# Altium schematic sheet TOP.SchDoc: =DocumentName
size A4; Organization: Queen's Formula SAE; Address1: 130 Stuart St, Kingston; Address2: Ontario; Address3: Canada; Address4: K7L 2V9; DocumentNumber: 1; Revision: 0; SheetNumber: 1; SheetTotal: 1
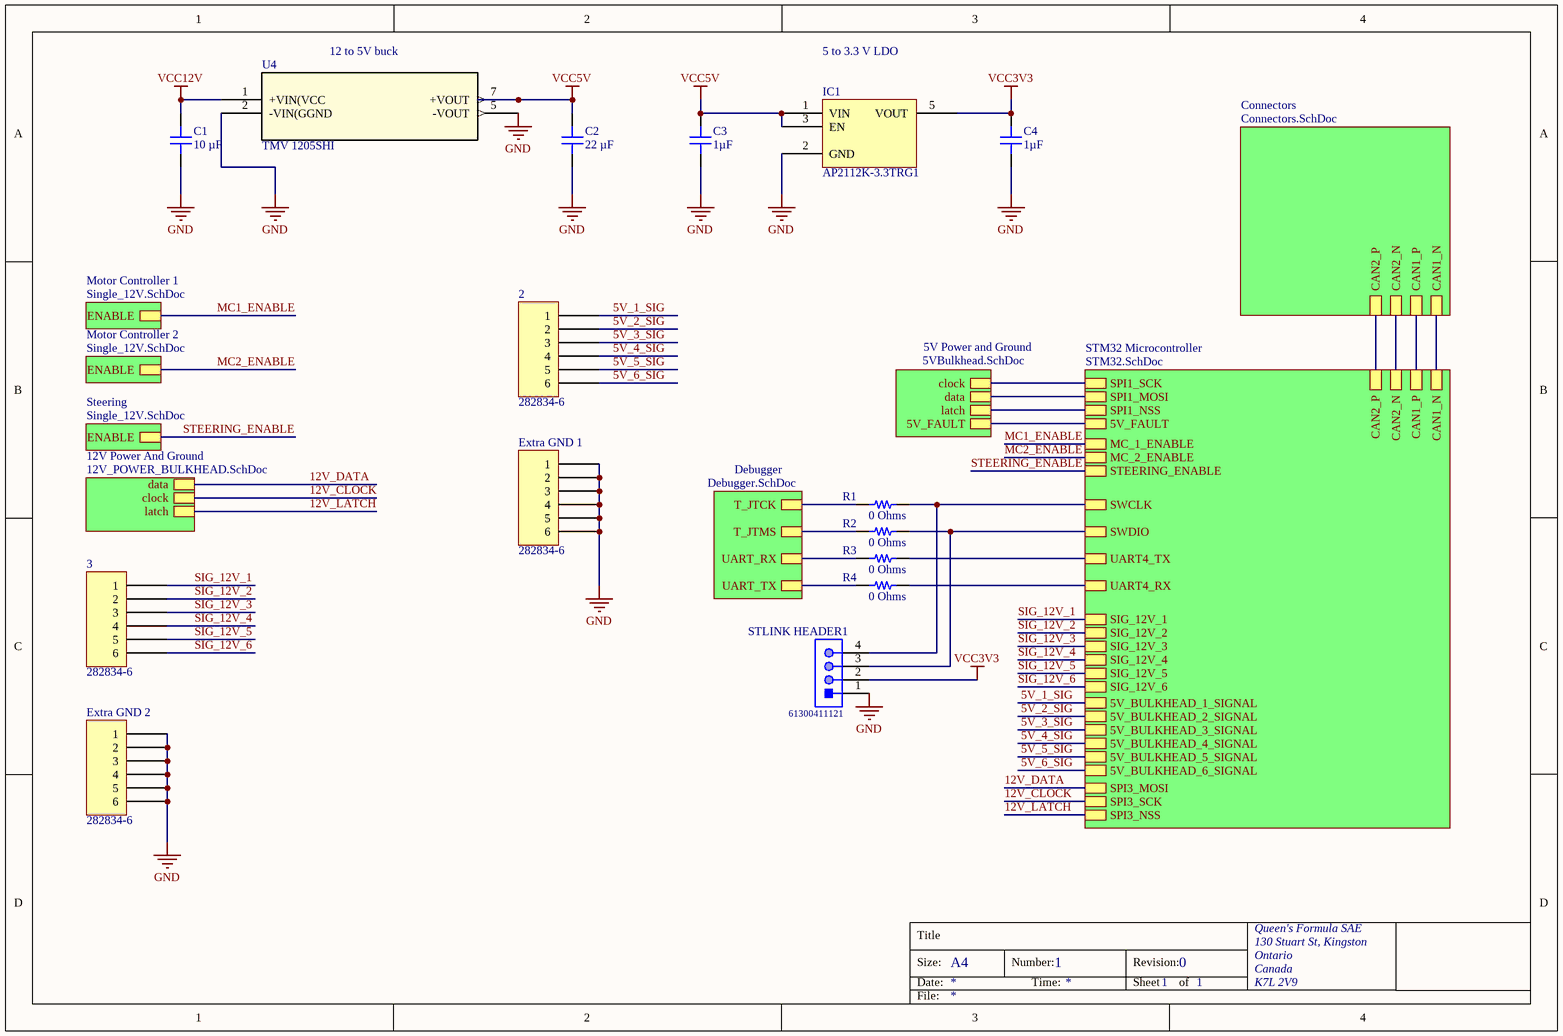
[diagram p0: TOP.SchDoc]

## Parts
2  282834-6  [TE 282834-6]
3  282834-6  [TE 282834-6]
C1  10 µF  [CAP 0603_1608]
C2  22 µF  [CAP 0603_1608]
C3  1µF  [CAP 0402_1005]
C4  1µF  [CAP 0402_1005]
Extra_GND_1  282834-6  [TE 282834-6]
Extra_GND_2  282834-6  [TE 282834-6]
IC1  AP2112K-3.3TRG1  [DIODES SOT-23-5 W5]
R1  0 Ohms  [RES 0603_1608]
R2  0 Ohms  [RES 0603_1608]
R3  0 Ohms  [RES 0603_1608]
R4  0 Ohms  [RES 0603_1608]
STLINK_HEADER1  61300411121  [61300411121]
U4  TMV 1205SHI  [TMV-HI_SINGLE_TRP]

## Sub-sheets
5V Power and Ground = 5VBulkhead.SchDoc: data, clock, latch, 5V_FAULT
12V Power And Ground = 12V_POWER_BULKHEAD.SchDoc: data, clock, latch
Connectors = Connectors.SchDoc: CAN1_N, CAN1_P, CAN2_N, CAN2_P
Debugger = Debugger.SchDoc: T_JTCK, T_JTMS, UART_RX, UART_TX
Motor Controller 1 = Single_12V.SchDoc: ENABLE
Motor Controller 2 = Single_12V.SchDoc: ENABLE
Steering = Single_12V.SchDoc: ENABLE
STM32 Microcontroller = STM32.SchDoc: SPI1_NSS, SPI1_SCK, SPI1_MOSI, MC_1_ENABLE, MC_2_ENABLE, STEERING_ENABLE, CAN1_P, CAN1_N, 5V_BULKHEAD_1_SIGNAL, 5V_BULKHEAD_2_SIGNAL, 5V_BULKHEAD_3_SIGNAL, 5V_BULKHEAD_4_SIGNAL, 5V_BULKHEAD_5_SIGNAL, 5V_BULKHEAD_6_SIGNAL, CAN2_N, CAN2_P, SWCLK, SPI3_NSS, SPI3_MOSI, SPI3_SCK, SIG_12V_1, SIG_12V_2, SIG_12V_3, SIG_12V_4, SIG_12V_5, SIG_12V_6, SWDIO, UART4_TX, UART4_RX, 5V_FAULT

## Nets
GND: C1.1 C2.1 C3.1 C4.1 Extra_GND_1.1 Extra_GND_1.2 Extra_GND_1.3 Extra_GND_1.4 Extra_GND_1.5 Extra_GND_1.6 Extra_GND_2.1 Extra_GND_2.2 Extra_GND_2.3 Extra_GND_2.4 Extra_GND_2.5 Extra_GND_2.6 IC1.2(GND) STLINK_HEADER1.1 U4.2(-VIN(GGND) U4.5(-VOUT)
VCC3V3: C4.2 IC1.5(VOUT) STLINK_HEADER1.2
VCC5V: C2.2 C3.2 IC1.1(VIN) IC1.3(EN) U4.7(+VOUT)
VCC12V: C1.2 U4.1(+VIN(VCC)
5V_1_SIG: 2.1 ; sheet STM32 Microcontroller/5V_BULKHEAD_1_SIGNAL
5V_2_SIG: 2.2 ; sheet STM32 Microcontroller/5V_BULKHEAD_2_SIGNAL
5V_3_SIG: 2.3 ; sheet STM32 Microcontroller/5V_BULKHEAD_3_SIGNAL
5V_4_SIG: 2.4 ; sheet STM32 Microcontroller/5V_BULKHEAD_4_SIGNAL
5V_5_SIG: 2.5 ; sheet STM32 Microcontroller/5V_BULKHEAD_5_SIGNAL
5V_6_SIG: 2.6 ; sheet STM32 Microcontroller/5V_BULKHEAD_6_SIGNAL
12V_CLOCK: sheet STM32 Microcontroller/SPI3_SCK, sheet 12V Power And Ground/clock
12V_DATA: sheet STM32 Microcontroller/SPI3_MOSI, sheet 12V Power And Ground/data
12V_LATCH: sheet STM32 Microcontroller/SPI3_NSS, sheet 12V Power And Ground/latch
MC1_ENABLE: sheet STM32 Microcontroller/MC_1_ENABLE, sheet Motor Controller 1/ENABLE
MC2_ENABLE: sheet STM32 Microcontroller/MC_2_ENABLE, sheet Motor Controller 2/ENABLE
SIG_12V_1: 3.1 ; sheet STM32 Microcontroller/SIG_12V_1
SIG_12V_2: 3.2 ; sheet STM32 Microcontroller/SIG_12V_2
SIG_12V_3: 3.3 ; sheet STM32 Microcontroller/SIG_12V_3
SIG_12V_4: 3.4 ; sheet STM32 Microcontroller/SIG_12V_4
SIG_12V_5: 3.5 ; sheet STM32 Microcontroller/SIG_12V_5
SIG_12V_6: 3.6 ; sheet STM32 Microcontroller/SIG_12V_6
STEERING_ENABLE: sheet STM32 Microcontroller/STEERING_ENABLE, sheet Steering/ENABLE
NetR1_1: R1.1 ; sheet Debugger/T_JTCK
NetR1_2: R1.2 STLINK_HEADER1.4 ; sheet STM32 Microcontroller/SWCLK
NetR2_1: R2.1 ; sheet Debugger/T_JTMS
NetR2_2: R2.2 STLINK_HEADER1.3 ; sheet STM32 Microcontroller/SWDIO
NetR3_1: R3.1 ; sheet Debugger/UART_RX
NetR3_2: R3.2 ; sheet STM32 Microcontroller/UART4_TX
NetR4_1: R4.1 ; sheet Debugger/UART_TX
NetR4_2: R4.2 ; sheet STM32 Microcontroller/UART4_RX
(unnamed): sheet STM32 Microcontroller/SPI1_NSS, sheet 5V Power and Ground/latch
(unnamed): sheet STM32 Microcontroller/SPI1_SCK, sheet 5V Power and Ground/clock
(unnamed): sheet STM32 Microcontroller/SPI1_MOSI, sheet 5V Power and Ground/data
(unnamed): sheet STM32 Microcontroller/CAN1_P, sheet Connectors/CAN1_P
(unnamed): sheet STM32 Microcontroller/CAN1_N, sheet Connectors/CAN1_N
(unnamed): sheet STM32 Microcontroller/CAN2_N, sheet Connectors/CAN2_N
(unnamed): sheet STM32 Microcontroller/CAN2_P, sheet Connectors/CAN2_P
(unnamed): sheet STM32 Microcontroller/5V_FAULT, sheet 5V Power and Ground/5V_FAULT

## Notes on the sheet
- (near U4) 12 to 5V buck
- 5 to 3.3 V LDO
- Title
- Size:
- Date:
- A4
- Number:
- Time:
- Revision:
- Sheet
- of
- File:

## Library data of the parts
2 3 Extra_GND_1 Extra_GND_2 = 282834-6: TERM BLK 6P SIDE ENT 2.54MM PCB; Manufacturer: TE Connectivity AMP Connectors; Current: 10A; Mating Orientation: Horizontal with Board; Number of Levels: 1; Pitch: 0.100" (2.54mm); Positions Per Level: 6; Voltage: 150V; Wire Gauge: 16-30 AWG; Wire Termination: Screw - Rising Cage Clamp; Part Number: 282834-6; Color: Green; ComponentLink1Description: Datasheet; ComponentLink1URL: https://www.te.com/commerce/DocumentDelivery/DDEController?Action=srchrtrv&DocNm=282834&DocType=Customer+Drawing&DocLang=English; ComponentLink2Description: DigiKey Link; ComponentLink2URL: http://digikey.com/product-detail/en/te-connectivity-amp-connectors/282834-6/A98337-ND/1153267; LastUpdated: 2020-01-15 4:16:31 AM; Lifecycle Status: Active; Minimum Order: 1; Mounting Type: Through Hole; Packaging: Bulk; Part Status: Active; Price: 4.72; Series: Buchanan; Supplier 1: DigiKey; Supplier Part Number 1: A98337-ND
C1 = GRT188R61C106ME13D: CAP CER 10UF 16V X5R 0603; manufacturer: Murata Electronics; Tolerance: ±20%; Part Number: GRT188R61C106ME13D; Value: 10 µF; Applications: Automotive; Capacitance: 10 µF; componentlink1description: Datasheet; componentlink1url: https://search.murata.co.jp/Ceramy/image/img/A01X/G101/ENG/GRT188R61C106ME13-01.pdf; componentlink2description: DigiKey Link; componentlink2url: https://www.digikey.com/en/products/detail/murata-electronics/GRT188R61C106ME13D/5416740; Device Package: 0603 (1608 Metric); lastupdated: 2023-06-11 7:15:06 PM; Lifecycle Status: Active; Minimum Order: 1; Mounting Type: Surface Mount, MLCC; Operating Temperature: -55°C ~ 85°C; Package / Case: 0603 (1608 Metric); packaging: TapeAndReel; partid: 2515; Part Status: Active; price: 0.06; Ratings: AEC-Q200; series: GRT; Size / Dimension: 0.063" L x 0.031" W (1.60mm x 0.80mm); Supplier 1: DigiKey; Supplier Part Number 1: 490-12318-1-ND; Temperature Coefficient: X5R; Thickness (Max): 0.035" (0.90mm); Voltage - Rated: 16V
C2 = ZRB186R60J226ME11L: CAP CER 22UF 6.3V X5R 0603; manufacturer: Murata Electronics; Tolerance: ±20%; Part Number: ZRB186R60J226ME11L; Value: 22 µF; Applications: Acoustic Noise Reduction; Capacitance: 22 µF; componentlink1description: Datasheet; componentlink1url: https://psearch.en.murata.com/capacitor/product/ZRB186R60J226ME11%23.pdf; componentlink2description: DigiKey Link; componentlink2url: https://www.digikey.com/en/products/detail/murata-electronics/ZRB186R60J226ME11L/5877417; Device Package: 0603 (1608 Metric); Features: Interposer Termination; lastupdated: 2023-06-11 7:15:06 PM; Lifecycle Status: Active; Minimum Order: 1; Mounting Type: Surface Mount, MLCC; Operating Temperature: -55°C ~ 85°C; Package / Case: 0603 (1608 Metric); packaging: TapeAndReel; partid: 2449; Part Status: Active; price: 0.05; series: ZRB; Size / Dimension: 0.063" L x 0.031" W (1.60mm x 0.80mm); Supplier 1: DigiKey; Supplier Part Number 1: 490-13254-1-ND; Temperature Coefficient: X5R; Thickness (Max): 0.031" (0.80mm); Voltage - Rated: 6.3V
C3 C4 = 0402ZD105KAT4A: CAP CER 1UF 10V X5R 0402; Manufacturer: AVX Corporation; Tolerance: ±10%; Part Number: 0402ZD105KAT4A; Value: 1µF; Applications: General Purpose; Capacitance: 1µF; ComponentLink1Description: Datasheet; ComponentLink1URL: http://datasheets.avx.com/cx5r.pdf; ComponentLink2Description: DigiKey Link; ComponentLink2URL: http://digikey.com/product-detail/en/avx-corporation/0402ZD105KAT4A/478-10063-1-ND/6564285; Device Package: 0402 (1005 Metric); LastUpdated: 2020-09-02 1:02:25 AM; Lifecycle Status: Active; Minimum Order: 1; Mounting Type: Surface Mount, MLCC; Operating Temperature: -55°C ~ 85°C; Package / Case: 0402 (1005 Metric); Packaging: TapeAndReel; PartId: 1846; Part Status: Active; Price: 0.02; Series: -; Size / Dimension: 0.039" L x 0.020" W (1.00mm x 0.50mm); Supplier 1: DigiKey; Supplier Part Number 1: 478-10063-1-ND; Temperature Coefficient: X5R; Thickness (Max): 0.022" (0.56mm); Voltage - Rated: 10V
IC1 = AP2112K-3.3TRG1: IC REG LINEAR 3.3V 600MA SOT25; Manufacturer: Diodes Incorporated; Control Features: Enable; Current - Quiescent (Iq): 80µA; Number of Regulators: 1; Output Configuration: Positive; Output Type: Fixed; Protection Features: Over Current, Over Temperature; PSRR: 65sB (100Hz ~ 1KHz); Voltage Dropout (Max): 0.4V @ 600mA; Voltage - Input (Max): 6V; Part Number: AP2112K-3.3TRG1; ComponentLink1Description: Datasheet; ComponentLink1URL: https://www.diodes.com/assets/Datasheets/AP2112.pdf; ComponentLink2Description: DigiKey Link; ComponentLink2URL: http://digikey.com/product-detail/en/diodes-incorporated/AP2112K-3.3TRG1/AP2112K-3.3TRG1DICT-ND/4505257; Current - Output: 600mA; LastUpdated: 2020-09-02 1:25:56 AM; Lifecycle Status: Active; Minimum Order: 1; Mounting Type: Surface Mount; Operating Temperature: -40°C ~ 85°C; Package / Case: SC-74A, SOT-753; Packaging: TapeAndReel; Part Status: Active; Price: 0.10; Series: -; Supplier 1: DigiKey; Supplier Part Number 1: AP2112K-3.3TRG1DICT-ND; Supplier Device Package: SOT-25; Voltage - Output (Min/Fixed): 3.3V
R1-R4 = TLRZ1JTTD: RES 0 OHM JUMPER 0603; Manufacturer: KOA Speer Electronics, Inc.; Part Number: TLRZ1JTTD; Value: 0 Ohms; ComponentLink1Description: Datasheet; ComponentLink1URL: http://www.koaspeer.com/catimages/Products/TLRZ/TLRZ.pdf; ComponentLink2Description: DigiKey Link; ComponentLink2URL: https://www.digikey.com/en/products/detail/koa-speer-electronics-inc/TLRZ1JTTD/9845493; Composition: Metal Element; Device Package: 0603 (1608 Metric); Features: Automotive AEC-Q200, Current Sense; Height - Seated (Max): 0.022" (0.55mm); LastUpdated: 2023-06-11 7:43:49 PM; Lifecycle Status: Active; Minimum Order: 1; Number of Terminations: 2; Operating Temperature: -55°C ~ 170°C; Package / Case: 0603 (1608 Metric); Packaging: TapeAndReel; PartId: 4851; Part Status: Active; Price: 0.08; Ratings: AEC-Q200; Resistance: 0 Ohms; Series: TLRZ; Size / Dimension: 0.063" L x 0.031" W (1.60mm x 0.80mm); Supplier 1: DigiKey; Supplier Part Number 1: 2019-TLRZ1JTTDCT-ND; Supplier Device Package: 0603; Tolerance: Jumper
STLINK_HEADER1 = CMP-1502-01064-1: THT Vertical Pin Header WR-PHD, Pitch 2.54 mm, Single Row, 4 pins; Manufacturer: Wurth Elektronik; Withstanding Voltage: 500VAC; Rated Current: 3A; Working Voltage: 250VAC; Pin Number: 4; Gender: Male; Contact Resistance: 20mOhm; Pitch: 2.54mm; Manufacturer URL: http://www.we-online.de; Operating Temperature: -40to105degC; Packaging: Bag; Mounting Technology: THT; Package Reference: 61300411121; Datasheet URL: https://katalog.we-online.de/em/datasheet/6130xx11121.pdf; Publisher: WurthElektronik; Part Number: 61300411121; Row Number: Single; Orientation: Vertical
U4 = CMP-01539-51129758-1: TMV 1205SHI Iso DC-DC Converter; Vin 10.8 to 13.2Vdc; Vout 5Vdc; I/O isolation 5200Vdc; Output Current: 200mA; Isolation Voltage: 5.2kV; Number of Outputs: 1; Output Voltage: 5V; Efficiency: 71%; Output Power: 1W; Max Operating Temperature: 85°C; Height: 10.2mm; Width: 7.5mm; Mount: Through Hole; Depth: 10.2mm; NexarPartId: 51129758; RoHS: Compliant; Min Operating Temperature: -40°C; Length: 19.5mm